# Altium schematic sheet SCE.SchDoc
size A4
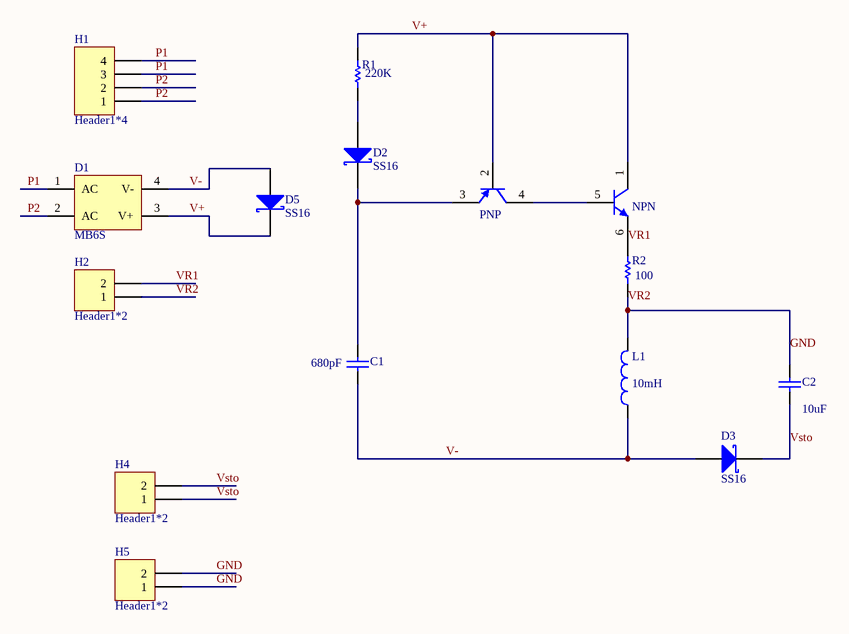
[diagram p0: SCE.SchDoc]

## Parts
C1  value 680pF  [RAD-0.1]  (hidden comment: Cap)
C2  value 10uF  [RB]  (hidden comment: Cap)
D1  MB6S  [MB6S]
D2  SS16  [SS16]
D3  SS16  [SS16]
D4  NPN  [xn4601]  (parts A,B of 2)
D5  SS16  [SS16]
H1  Header1*4  [Header1*4]
H2  Header1*2  [Header1*2]
H4  Header1*2  [Header1*2]
H5  Header1*2  [Header1*2]
L1  value 10mH  [Inductance]  (hidden comment: Inductor)
R1  value 220K  [RES]  (hidden comment: Res1)
R2  value 100  [res]  (hidden comment: Res1)

## Nets
GND: C2.2 H2.1 H5.1 H5.2 L1.2 R2.1  [also labelled VR2]
P1: D1.1(AC) H1.3 H1.4
P2: D1.2(AC) H1.1 H1.2
V+: D1.3(V+) D4.1(C) D4.2(B) D5.2(K) R1.2
V-: C1.1 D1.4(V-) D3.1(A) D5.1(A) L1.1
VR1: D4.6(E) H2.2 R2.2
Vsto: C2.1 D3.2(K) H4.1 H4.2
NetC1_2: C1.2 D2.2(K) D4.3(E)
NetD2_1: D2.1(A) R1.1
NetD4_4: D4.4(C) D4.5(B)

## Library data of the parts
C1 C2 = Cap: Capacitor; Published: 8-Jun-2000; LatestRevisionDate: 17-Jul-2002; LatestRevisionNote: Re-released for DXP Platform.; PackageReference: RAD-0.3; Publisher: Altium Limited; PackageDescription: Radial Cap, Thru-Hole; 2 Leads; 0.3 in Pin Spacing
D1 = MB6S: Diode Bridge; Published: 24-Mar-1999; LatestRevisionDate: 17-Jul-2002; LatestRevisionNote: Re-released for DXP Platform.; PackageReference: D-46_6A; Publisher: Altium Limited; PackageDescription: Bridge Rectifier; 4 Terminals; Body 16.8 x 16.8 mm (typ); Pitch 10.67 mm
D2 D3 D5 = SS16: Schottky Diode; Published: 8-Jun-2000; LatestRevisionDate: 17-Jul-2002; LatestRevisionNote: Re-released for DXP Platform.; PackageReference: SMB; Publisher: Altium Limited; PackageDescription: DO-214-AA/SMB; 2 C-Bend Leads; Body 5.3 x 3.6 mm, inc. leads (LxW); Code_JEDEC: DO-214-AA
D4 = XN4601: Composite Transistors
L1 = Inductor: Code_IEC: 1005; Published: 8-Jun-2000; LatestRevisionDate: 29-May-2009; LatestRevisionNote: IPC-7351 Footprint Added.; PackageReference: 0402-A; Publisher: Altium Limited; PackageDescription: Chip Inductor; Code_JEITA: 0402
R1 R2 = Res1: Resistor; Published: 8-Jun-2000; LatestRevisionDate: 17-Jul-2002; LatestRevisionNote: Re-released for DXP Platform.; PackageReference: AXIAL-0.3; Publisher: Altium Limited; PackageDescription: Axial Device, Thru-Hole; 2 Leads; 0.3 in Pin Spacing